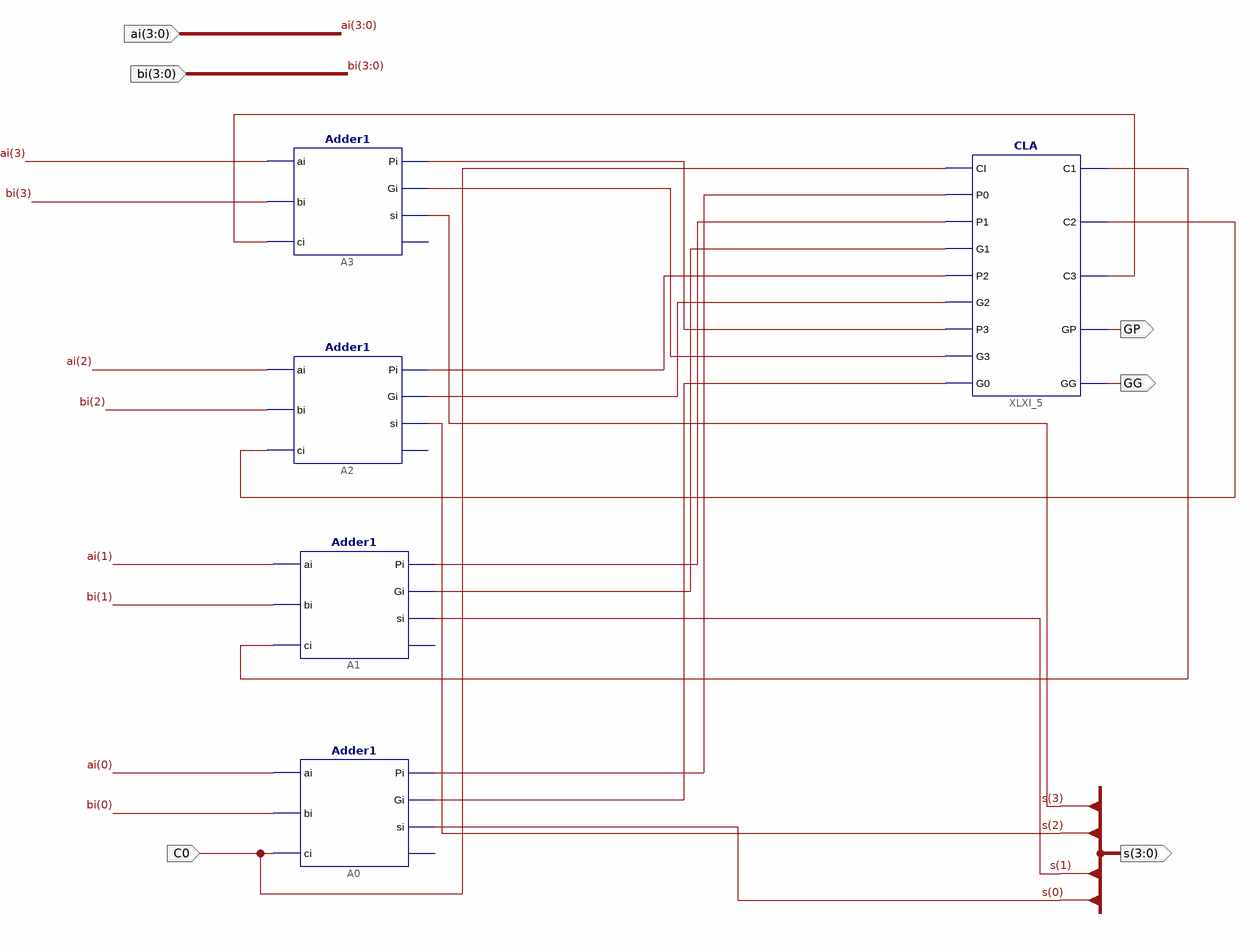
[diagram p0: schematic sheet 1]
// Xilinx ISE schematic add4b.sch (kintex7) as structural Verilog: 5 symbols, 6 ports
module add4b (
  input  [3:0] ai,
  input  [3:0] bi,
  input  C0,
  output GP,
  output GG,
  output [3:0] s
);

  wire XLXN_24, XLXN_25, XLXN_26, XLXN_30, XLXN_31, XLXN_32, XLXN_33, XLXN_34, XLXN_35, XLXN_36, XLXN_37;

  Adder1 A3 (.ai(ai[3]), .bi(bi[3]), .ci(XLXN_24), .Pi(XLXN_34), .Gi(XLXN_33), .si(s[3]));  // open: co
  Adder1 A2 (.ai(ai[2]), .bi(bi[2]), .ci(XLXN_25), .Pi(XLXN_35), .Gi(XLXN_30), .si(s[2]));  // open: co
  Adder1 A1 (.ai(ai[1]), .bi(bi[1]), .ci(XLXN_26), .Pi(XLXN_36), .Gi(XLXN_31), .si(s[1]));  // open: co
  Adder1 A0 (.ai(ai[0]), .bi(bi[0]), .ci(C0), .Pi(XLXN_37), .Gi(XLXN_32), .si(s[0]));  // open: co
  CLA XLXI_5 (
    .CI(C0), .P0(XLXN_37), .P1(XLXN_36), .G1(XLXN_31), .P2(XLXN_35), .G2(XLXN_30), .P3(XLXN_34),
    .G3(XLXN_33), .G0(XLXN_32), .C1(XLXN_26), .C2(XLXN_25), .C3(XLXN_24), .GP(GP), .GG(GG));
endmodule
